# EAGLE schematic Z80_Video (EAGLE 5.10)
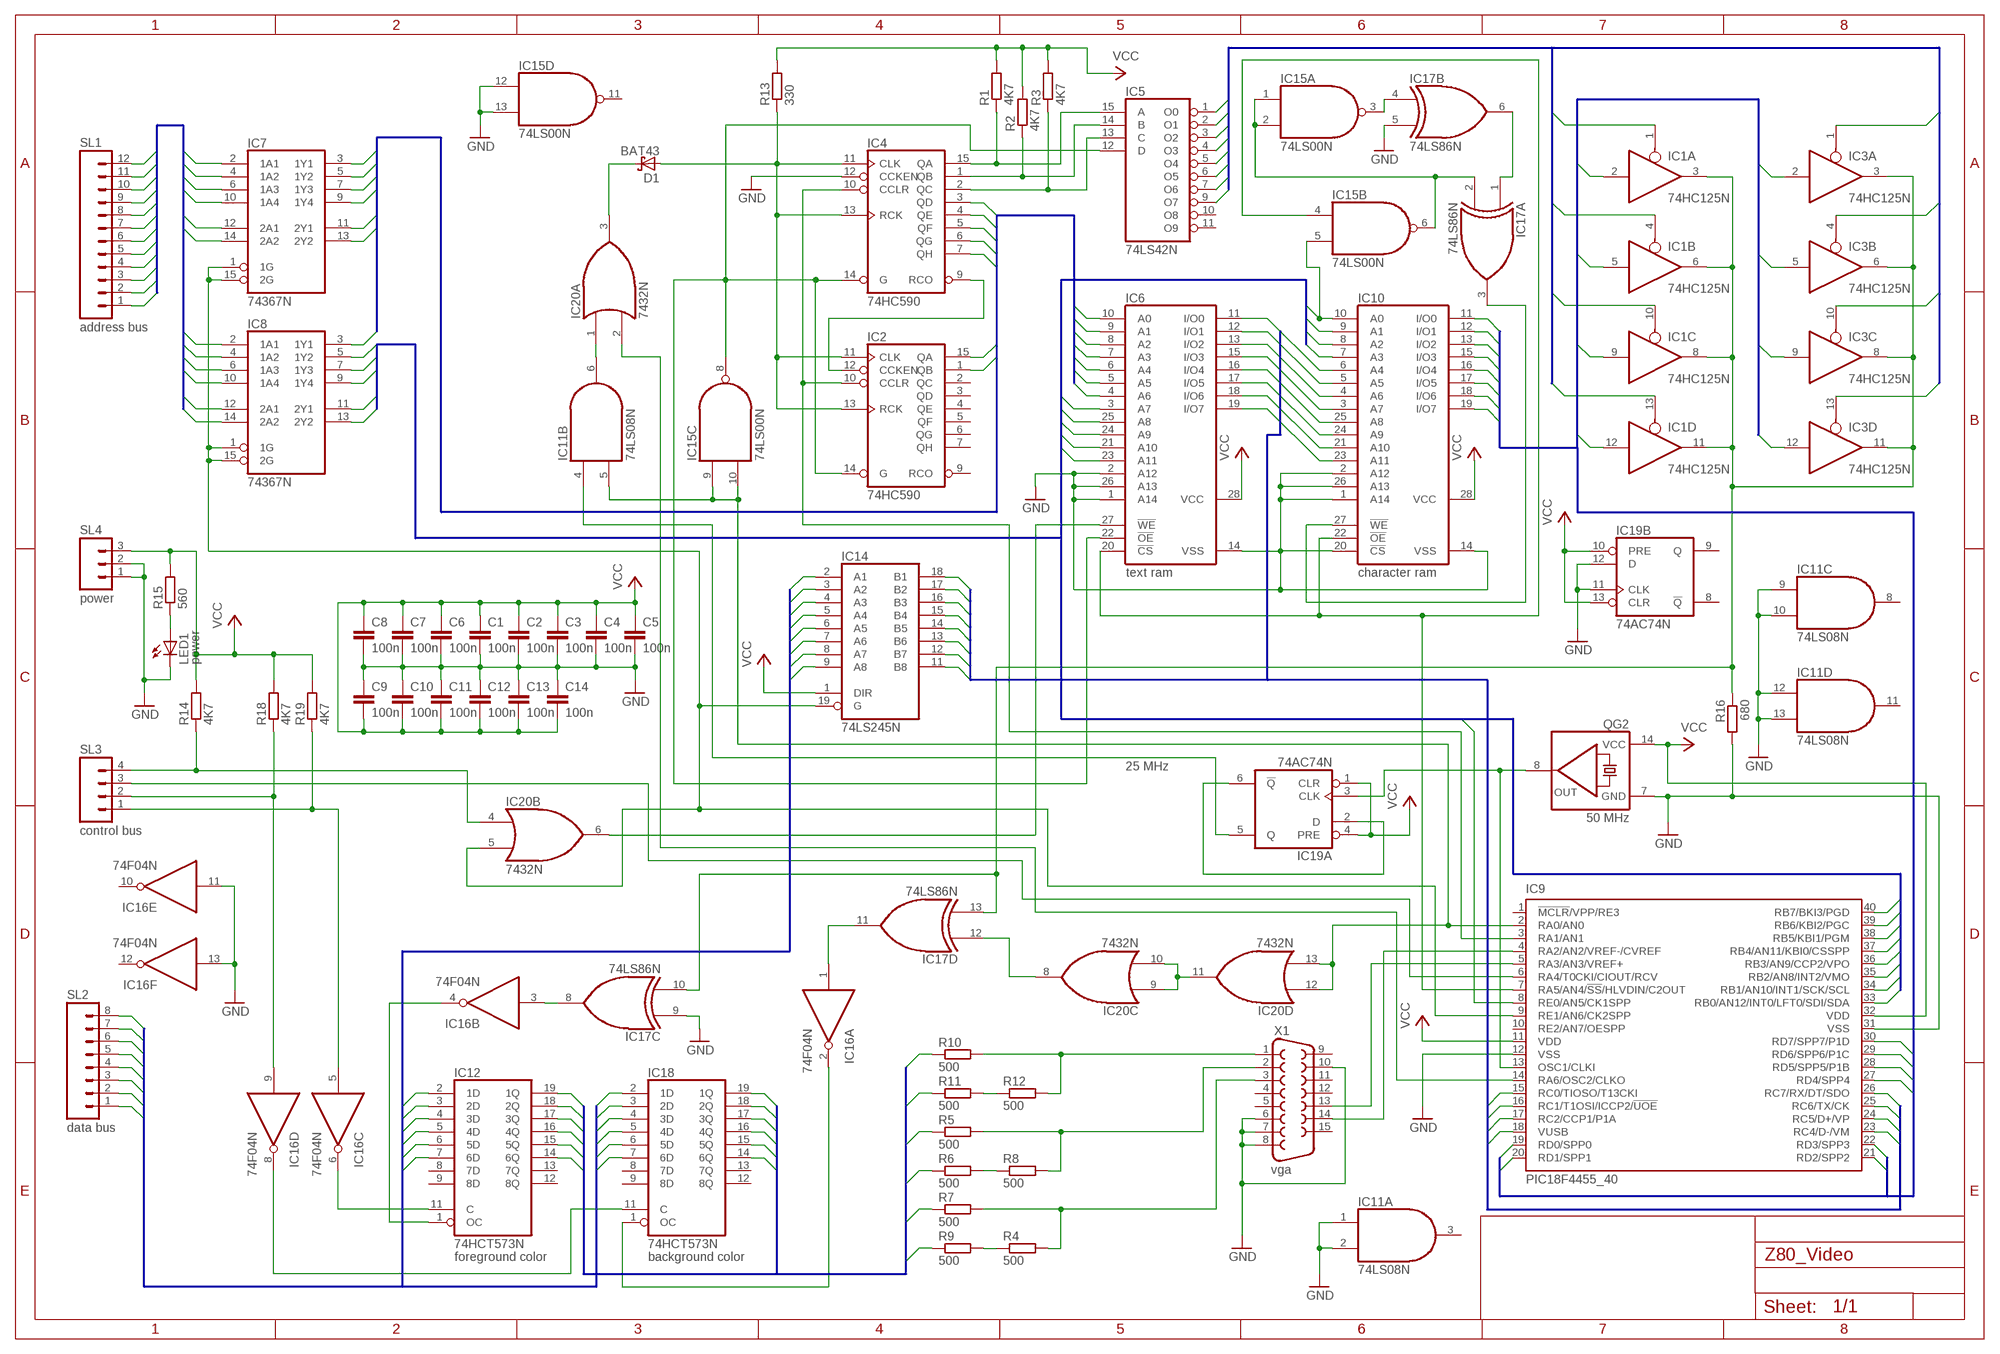
[diagram p0: schematic, sheet 1]

## Parts
C1  100n  C-EU050-025X075  [C050-025X075]
C2  100n  C-EU050-025X075  [C050-025X075]
C3  100n  C-EU050-025X075  [C050-025X075]
C4  100n  C-EU050-025X075  [C050-025X075]
C5  100n  C-EU050-025X075  [C050-025X075]
C6  100n  C-EU050-025X075  [C050-025X075]
C7  100n  C-EU050-025X075  [C050-025X075]
C8  100n  C-EU050-025X075  [C050-025X075]
C9  100n  C-EU050-025X075  [C050-025X075]
C10  100n  C-EU050-025X075  [C050-025X075]
C11  100n  C-EU050-025X075  [C050-025X075]
C12  100n  C-EU050-025X075  [C050-025X075]
C13  100n  C-EU050-025X075  [C050-025X075]
C14  100n  C-EU050-025X075  [C050-025X075]
D1  BAT43  BAT42  [DO35-10]
IC1  74HC125N  74LS125N  [DIL14]
IC2  74HC590  74LS590N  [DIL16]
IC3  74HC125N  74LS125N  [DIL14]
IC4  74HC590  74LS590N  [DIL16]
IC5  74LS42N  [DIL16]
IC6  text ram  62832P  [DIL28-3]
IC7  74367N  [DIL16]
IC8  74367N  [DIL16]
IC9  PIC18F4455_40  [DIL40]
IC10  character ram  62832P  [DIL28-3]
IC11  74LS08N  74S08N  [DIL14]
IC12  74HCT573N  74HC573N  [DIL20]
IC14  74LS245N  [DIL20]
IC15  74LS00N  [DIL14]
IC16  74F04N  74S04N  [DIL14]
IC17  74LS86N  [DIL14]
IC18  74HCT573N  74HC573N  [DIL20]
IC19  74AC74N  74S74N  [DIL14]
IC20  7432N  74LS32N  [DIL14]
LED1  power  LED5MM  [LED5MM]
QG2  50 MHz  QG5860  [DIL14S]
R1  4K7  R-EU_0207/10  [0207/10]
R2  4K7  R-EU_0207/10  [0207/10]
R3  4K7  R-EU_0207/10  [0207/10]
R4  500  R-EU_0207/10  [0207/10]
R5  500  R-EU_0207/10  [0207/10]
R6  500  R-EU_0207/10  [0207/10]
R7  500  R-EU_0207/10  [0207/10]
R8  500  R-EU_0207/10  [0207/10]
R9  500  R-EU_0207/10  [0207/10]
R10  500  R-EU_0207/10  [0207/10]
R11  500  R-EU_0207/10  [0207/10]
R12  500  R-EU_0207/10  [0207/10]
R13  330  R-EU_0207/10  [0207/10]
R14  4K7  R-EU_0207/10  [0207/10]
R15  560  R-EU_0207/10  [0207/10]
R16  680  R-EU_0207/10  [0207/10]
R18  4K7  R-EU_0207/10  [0207/10]
R19  4K7  R-EU_0207/10  [0207/10]
SL1  address bus  M12  [12P]
SL2  data bus  M08  [08P]
SL3  control bus  M04  [04P]
SL4  power  M03  [03P]
X1  vga  F15HDH  [HDF15H]

## Nets
/BG_PIXEL: IC16.2(A:O) IC18.1(OC)
/CLR_CNT: IC2.10(CCLR) IC4.10(CCLR) IC9.3(RA1/AN1)
/EN_RAMACCESS: IC7.1(1G) IC7.15(2G) IC8.1(1G) IC8.15(2G) IC9.9(RE1/AN6/CK2SPP) IC14.19(G) IC20.5(B:I1)
/FG_PIXEL: IC12.1(OC) IC16.4(B:O)
/H_SYNC: IC9.5(RA3/AN3/VREF+) X1.13
/H_VISIBLE: IC2.14(G) IC4.14(G) IC5.12(D) IC6.22(!OE) IC15.8(C:O)
/V_SYNC: IC9.4(RA2/AN2/VREF-/CVREF) X1.14
/VRAM_BUSY: IC9.6(RA4/T0CKI/CIOUT/RCV) SL3.3
/WE2: IC10.27(!WE) IC17.3(A:O)
/WR_BGCOLOR: IC16.9(D:I) R18.1 SL3.2
/WR_FGCOLOR: IC16.5(C:I) R19.1 SL3.1
/WR_VRAM: IC20.4(B:I0) R14.1 SL3.4
/WR_VRAM_OK: IC6.27(!WE) IC20.6(B:O)
A0: IC4.3(QD) IC6.10(A0) IC7.3(1Y1)
A1: IC4.4(QE) IC6.9(A1) IC7.5(1Y2)
A2: IC4.5(QF) IC6.8(A2) IC7.7(1Y3)
A3: IC4.6(QG) IC6.7(A3) IC7.9(1Y4)
A4: IC4.7(QH) IC6.6(A4) IC7.11(2Y1)
A5: IC2.15(QA) IC6.5(A5) IC7.13(2Y2)
A6: IC2.1(QB) IC6.4(A6) IC8.3(1Y1)
A7: IC6.3(A7) IC8.5(1Y2) IC9.37(RB4/AN11/KBI0/CSSPP)
A8: IC6.25(A8) IC8.7(1Y3) IC9.38(RB5/KBI1/PGM)
A9: IC6.24(A9) IC8.9(1Y4) IC9.39(RB6/KBI2/PGC)
A10: IC6.21(A10) IC8.11(2Y1) IC9.40(RB7/BKI3/PGD)
A11: IC6.23(A11) IC8.13(2Y2) IC9.8(RE0/AN5/CK1SPP)
AC0: IC9.33(RB0/AN12/INT0/LFT0/SDI/SDA) IC10.10(A0) IC15.5(B:I1)
AC1: IC9.34(RB1/AN10/INT1/SCK/SCL) IC10.9(A1)
AC2: IC9.35(RB2/AN8/INT2/VMO) IC10.8(A2)
AC3: IC9.36(RB3/AN9/CCP2/VPO) IC10.7(A3)
BG_PIXEL: IC16.1(A:I) IC17.11(D:O)
CLKI: IC9.13(OSC1/CLKI) IC19.3(A:CLK) QG2.8(OUT)
CNT_CLK: IC9.14(RA6/OSC2/CLKO) IC20.2(A:I1)
CPU_A0: IC7.2(1A1) SL1.1
CPU_A1: IC7.4(1A2) SL1.2
CPU_A2: IC7.6(1A3) SL1.3
CPU_A3: IC7.10(1A4) SL1.4
CPU_A4: IC7.12(2A1) SL1.5
CPU_A5: IC7.14(2A2) SL1.6
CPU_A6: IC8.2(1A1) SL1.7
CPU_A7: IC8.4(1A2) SL1.8
CPU_A8: IC8.6(1A3) SL1.9
CPU_A9: IC8.10(1A4) SL1.10
CPU_A10: IC8.12(2A1) SL1.11
CPU_A11: IC8.14(2A2) SL1.12
D0: IC12.2(1D) IC14.2(A1) IC18.2(1D) SL2.1
D1: IC12.3(2D) IC14.3(A2) IC18.3(2D) SL2.2
D2: IC12.4(3D) IC14.4(A3) IC18.4(3D) SL2.3
D3: IC12.5(4D) IC14.5(A4) IC18.5(4D) SL2.4
D4: IC12.6(5D) IC14.6(A5) IC18.6(5D) SL2.5
D5: IC12.7(6D) IC14.7(A6) IC18.7(6D) SL2.6
D6: IC14.8(A7) SL2.7
D7: IC14.9(A8) SL2.8
FG_PIXEL: IC16.3(B:I) IC17.8(C:O)
GND: C1.2 C2.2 C3.2 C4.2 C5.2 C6.2 C7.2 C8.2 C9.1 C10.1 C11.1 C12.1 C13.1 C14.1 IC4.12(CCKEN) IC6.1(A14) IC6.2(A12) IC6.14(VSS) IC6.26(A13) IC9.12(VSS) IC9.31(VSS) IC10.1(A14) IC10.2(A12) IC10.14(VSS) IC10.20(!CS) IC10.26(A13) IC11.1(A:I0) IC11.2(A:I1) IC11.9(C:I0) IC11.10(C:I1) IC11.12(D:I0) IC11.13(D:I1) IC15.12(D:I0) IC15.13(D:I1) IC16.11(E:I) IC16.13(F:I) IC17.5(B:I1) IC17.9(C:I0) IC19.11(B:CLK) IC19.12(B:D) LED1.K(C) QG2.7(GND) R16.2 SL4.1 SL4.2 X1.6 X1.7 X1.8 X1.10
H_VISIBLE: IC9.2(RA0/AN0) IC11.5(B:I1) IC15.9(C:I0) IC15.10(C:I1) IC20.12(D:I0) IC20.13(D:I1)
H_VISIBLE_D1: IC20.9(C:I0) IC20.10(C:I1) IC20.11(D:O)
H_VISIBLE_D2: IC17.12(D:I0) IC20.8(C:O)
I/O0: IC1.2(A:I) IC9.19(RD0/SPP0) IC10.11(I/O0)
I/O1: IC1.5(B:I) IC9.20(RD1/SPP1) IC10.12(I/O1)
I/O2: IC1.9(C:I) IC9.21(RD2/SPP2) IC10.13(I/O2)
I/O3: IC1.12(D:I) IC9.22(RD3/SPP3) IC10.15(I/O3)
I/O4: IC3.2(A:I) IC9.27(RD4/SPP4) IC10.16(I/O4)
I/O5: IC3.5(B:I) IC9.28(RD5/SPP5/P1B) IC10.17(I/O5)
I/O6: IC3.9(C:I) IC9.29(RD6/SPP6/P1C) IC10.18(I/O6)
I/O7: IC3.12(D:I) IC9.30(RD7/SPP7/P1D) IC10.19(I/O7)
N$1: R4.1 R9.2
N$2: R6.2 R8.1
N$3: R11.2 R12.1
N$4: IC15.3(A:O) IC17.4(B:I0)
N$5: D1.C IC20.3(A:O)
N$6: LED1.A R15.1
N$14: IC19.2(A:D) IC19.6(A:!Q)
N$15: IC17.1(A:I0) IC17.6(B:O)
N$16: D1.A IC2.11(CLK) IC2.13(RCK) IC4.11(CLK) IC4.13(RCK) R13.1
N$17: IC11.6(B:O) IC20.1(A:I0)
N$34: IC4.15(QA) IC5.15(A) R1.1
N$35: IC4.1(QB) IC5.14(B) R2.1
N$36: IC4.2(QC) IC5.13(C) R3.1
N$39: IC2.12(CCKEN) IC4.9(RCO)
N$58: IC15.1(A:I0) IC15.2(A:I1) IC15.6(B:O) IC17.2(A:I1)
O0: IC3.13(D:OE) IC5.1(O0)
O1: IC3.10(C:OE) IC5.2(O1)
O2: IC3.4(B:OE) IC5.3(O2)
O3: IC3.1(A:OE) IC5.4(O3)
O4: IC1.13(D:OE) IC5.5(O4)
O5: IC1.10(C:OE) IC5.6(O5)
O6: IC1.4(B:OE) IC5.7(O6)
O7: IC1.1(A:OE) IC5.9(O7)
PIXEL_CLK: IC11.4(B:I0) IC19.5(A:Q)
PIXEL_OUT: IC1.3(A:O) IC1.6(B:O) IC1.8(C:O) IC1.11(D:O) IC3.3(A:O) IC3.6(B:O) IC3.8(C:O) IC3.11(D:O) IC17.10(C:I1) IC17.13(D:I1) R16.1
RC0: IC6.11(I/O0) IC9.15(RC0/TIOSO/T13CKI) IC10.6(A4) IC14.18(B1)
RC1: IC6.12(I/O1) IC9.16(RC1/T1OSI/ICCP2/!UOE) IC10.5(A5) IC14.17(B2)
RC2: IC6.13(I/O2) IC9.17(RC2/CCP1/P1A) IC10.4(A6) IC14.16(B3)
RC3: IC6.15(I/O3) IC9.18(VUSB) IC10.3(A7) IC14.15(B4)
RC4: IC6.16(I/O4) IC9.23(RC4/D-/VM) IC10.25(A8) IC14.14(B5)
RC5: IC6.17(I/O5) IC9.24(RC5/D+/VP) IC10.24(A9) IC14.13(B6)
RC6: IC6.18(I/O6) IC9.25(RC6/TX/CK) IC10.21(A10) IC14.12(B7)
RC7: IC6.19(I/O7) IC9.26(RC7/RX/DT/SDO) IC10.23(A11) IC14.11(B8)
RGB0: IC12.19(1Q) IC18.19(1Q) R10.1
RGB1: IC12.18(2Q) IC18.18(2Q) R11.1
RGB2: IC12.17(3Q) IC18.17(3Q) R5.1
RGB3: IC12.16(4Q) IC18.16(4Q) R6.1
RGB4: IC12.15(5Q) IC18.15(5Q) R7.1
RGB5: IC12.14(6Q) IC18.14(6Q) R9.1
RGB_B: R4.2 R7.2 X1.3
RGB_G: R5.2 R8.2 X1.2
RGB_R: R10.2 R12.2 X1.1
VCC: C1.1 C2.1 C3.1 C4.1 C5.1 C6.1 C7.1 C8.1 C9.2 C10.2 C11.2 C12.2 C13.2 C14.2 IC6.28(VCC) IC9.11(VDD) IC9.32(VDD) IC10.28(VCC) IC14.1(DIR) IC19.1(A:CLR) IC19.4(A:PRE) IC19.10(B:PRE) IC19.13(B:CLR) QG2.14(VCC) R1.2 R2.2 R3.2 R13.2 R14.2 R15.2 R18.2 R19.2 SL4.3
WR_BGCOLOR: IC16.8(D:O) IC18.11(C)
WR_CHARRAM: IC6.20(!CS) IC9.7(RA5/AN4/!SS!/HLVDIN/C2OUT) IC10.22(!OE) IC15.4(B:I0)
WR_FGCOLOR: IC12.11(C) IC16.6(C:O)
Unconnected: IC2.2(QC) IC2.3(QD) IC2.4(QE) IC2.5(QF) IC2.6(QG) IC2.7(QH) IC2.9(RCO) IC5.10(O8) IC5.11(O9) IC9.1(!MCLR!/VPP/RE3) IC9.10(RE2/AN7/OESPP) IC11.3(A:O) IC11.8(C:O) IC11.11(D:O) IC12.8(7D) IC12.9(8D) IC12.12(8Q) IC12.13(7Q) IC15.11(D:O) IC16.10(E:O) IC16.12(F:O) IC18.8(7D) IC18.9(8D) IC18.12(8Q) IC18.13(7Q) IC19.8(B:!Q) IC19.9(B:Q) X1.4 X1.5 X1.9 X1.11 X1.12 X1.15

## Buses
I/O[0..7]
O[0..7]
RC[0..7]
AC[0..3],A[7..11]
A[0..6]
RGB[0..5]
D[0..7]
CPU_A[0..11]

## Notes on the sheet
- 25 MHz
- foreground color | background color

## Power pins joined to a net without a drawn wire
GND: IC1.7(P:GND) IC2.8(GND) IC3.7(P:GND) IC4.8(GND) IC5.8(GND) IC7.8(GND) IC8.8(GND) IC11.7(P:GND) IC12.10(GND) IC14.10(GND) IC15.7(P:GND) IC16.7(P:GND) IC17.7(P:GND) IC18.10(GND) IC19.7(P:GND) IC20.7(P:GND)
VCC: IC1.14(P:VCC) IC2.16(VCC) IC3.14(P:VCC) IC4.16(VCC) IC5.16(VCC) IC7.16(VCC) IC8.16(VCC) IC11.14(P:VCC) IC12.20(VCC) IC14.20(VCC) IC15.14(P:VCC) IC16.14(P:VCC) IC17.14(P:VCC) IC18.20(VCC) IC19.14(P:VCC) IC20.14(P:VCC)

## Library data of the parts
C1-C14 = rcl:C-EU: CAPACITOR, European symbol
D1 = diode:BAT42: DIODE barrier diode
IC1 IC3 = 74xx-us:74*125: Quad bus BUFFER, 3-state
IC2 IC4 = 74xx-us:74*590: 8-bit binary COUNTER, output register
IC5 = 74xx-us:74*42: 4-line to 10-line DECODER (1-of-10)
IC6 IC10 = memory-hitachi:62832P: MEMORY
IC7 IC8 = 74xx-us:74*367: Hex BUS DRIVER, 3-state
IC9 = microchip:PIC18F4*_40: USB Microcontrollers with nanoWatt Technology High-Performance, Enhanced Flash, 28/40/44-Pin, Source: http://ww1.microchip.com/downloads/en/devicedoc/39632c.pdf
IC11 = 74xx-us:74*08: Quad 2-input AND gate
IC12 IC18 = 74xx-us:74*573: 8-bit D latch BUS DRIVER
IC14 = 74xx-us:74*245: Octal BUS TRANSCEIVER, 3-state
IC15 = 74xx-us:74*00: Quad 2-input NAND gate
IC16 = 74xx-us:74*04: Hex INVERTER
IC17 = 74xx-us:74*86: Quad 2-input EXCLUSIV-OR (XOR) gate
IC19 = 74xx-us:74*74: Dual D type positive edge triggered FLIP FLOP, preset and clear
IC20 = 74xx-us:74*32: Quad 2-input OR gate
LED1 = led:LED: LED OSRAM: - CHIPLED LG R971, LG N971, LY N971, LG Q971, LY Q971, LO R971, LY R971 LH N974, LH R974 LS Q976, LO Q976, LY Q976 LO Q996 - Hyper CHIPLED LW Q18S LB Q993, LB Q99A, LB R99A - SideLED LS A670, LO A670, LY A670, LG A670, LP A670 LB A673, LV A673, LT A673, LW A673 LH A674 LY A675 LS A676, LA A676, LO A676, LY A676, LW A676 LS A679, LY A679, LG A679 - Hyper Micro SIDELED® LS Y876, LA Y876, LO Y876, LY Y876 LT Y87S - SmartLED LW L88C, LW L88S LB L89C, LB L89S, LG L890 LS L89K, LO L89K, LY L89K LS L896, LA L896, LO L896, LY L896 - TOPLED LS T670, LO T670, LY T670, LG T670, LP T670 LSG T670, LSP T670, LSY T670, LOP T670, LYG T670 LG T671, LOG T671, LSG T671 LB T673, LV T673, LT T673, LW T673 LH T674 LS T676, LA T676, LO T676, LY T676, LB T676, LH T676, LSB T676, LW T676 LB T67C, LV T67C, LT T67C, LS T67K, LO T67K, LY T67K, LW E67C LS E67B, LA E67B, LO E67B, LY E67B, LB E67C, LV E67C, LT E67C LW T67C LS T679, LY T679, LG T679 LS T770, LO T770, LY T770, LG T770, LP T770 LB T773, LV T773, LT T773, LW T773 LH T774 LS E675, LA E675, LY E675, LS T675 LS T776, LA T776, LO T776, LY T776, LB T776 LHGB T686 LT T68C, LB T68C - Hyper Mini TOPLED® LB M676 - Mini TOPLED Santana® LG M470 LS M47K, LO M47K, LY M47K Source: http://www.osram.convergy.de LUXEON: - LUMILED® LXK2-PW12-R00, LXK2-PW12-S00, LXK2-PW14-U00, LXK2-PW14-V00 LXK2-PM12-R00, LXK2-PM12-S00, LXK2-PM14-U00 LXK2-PE12-Q00, LXK2-PE12-R00, LXK2-PE12-S00, LXK2-PE14-T00, LXK2-PE14-U00 LXK2-PB12-K00, LXK2-PB12-L00, LXK2-PB12-M00, LXK2-PB14-N00, LXK2-PB14-P00, LXK2-PB14-Q00 LXK2-PR12-L00, LXK2-PR12-M00, LXK2-PR14-Q00, LXK2-PR14-R00 LXK2-PD12-Q00, LXK2-PD12-R00, LXK2-PD12-S00 LXK2-PH12-R00, LXK2-PH12-S00 LXK2-PL12-P00, LXK2-PL12-Q00, LXK2-PL12-R00 Source: www.luxeon.com KINGBRIGHT: KA-3528ASYC Source: www.kingbright.com
QG2 = crystal:QG5860: CRYSTAL RESONATOR
R1-R16 R18 R19 = resistor:R-EU_: RESISTOR, European symbol
SL1 = con-amp-quick:M12: AMP QUICK CONNECTOR
SL2 = con-amp-quick:M08: AMP QUICK CONNECTOR
SL3 = con-amp-quick:M04: AMP QUICK CONNECTOR
SL4 = con-amp-quick:M03: AMP QUICK CONNECTOR
X1 = con-subd:F15: SUB-D